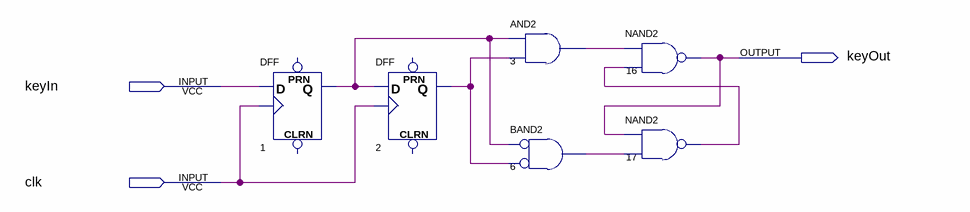
[diagram p0: schematic sheet]
// Quartus schematic debounce.bdf as structural Verilog: 6 symbols, 3 pins
module debounce (
  input  keyIn,
  input  clk,
  output keyOut
);

  wire n1_q, n2_q, n3_out, n6_out, n17_out;

  DFF u_1 (.CLK(clk), .D(keyIn), .Q(n1_q));  // open: CLRN, PRN
  DFF u_2 (.CLK(clk), .D(n1_q), .Q(n2_q));  // open: CLRN, PRN
  and u_3 (n3_out, n1_q, n2_q);
  and u_6 (n6_out, ~n1_q, ~n2_q);  // BAND2
  nand u_16 (keyOut, n3_out, n17_out);
  nand u_17 (n17_out, keyOut, n6_out);
endmodule
